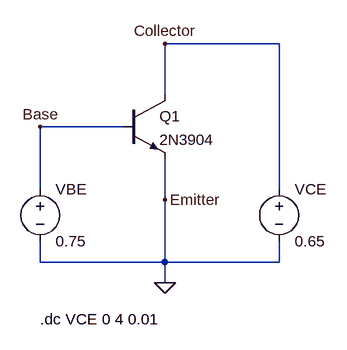
[diagram p0: schematic Lab7p1.asc]
Lab7p1.asc, the LTspice schematic file:
Version 4
SHEET 1 880 680
WIRE 464 -80 288 -80
WIRE 288 0 288 -80
WIRE 224 48 96 48
WIRE 96 144 96 48
WIRE 464 144 464 -80
WIRE 288 160 288 96
WIRE 96 256 96 224
WIRE 288 256 288 160
WIRE 288 256 96 256
WIRE 464 256 464 224
WIRE 464 256 288 256
WIRE 288 288 288 256
FLAG 288 288 0
FLAG 288 -80 Collector
FLAG 96 48 Base
FLAG 288 160 Emitter
SYMBOL voltage 96 128 R0
WINDOW 123 0 0 Left 0
WINDOW 39 0 0 Left 0
SYMATTR InstName VBE
SYMATTR Value 0.75
SYMBOL voltage 464 128 R0
WINDOW 123 0 0 Left 0
WINDOW 39 0 0 Left 0
SYMATTR InstName VCE
SYMATTR Value 0.65
SYMBOL npn 224 0 R0
SYMATTR InstName Q1
SYMATTR Value 2N3904
TEXT 96 344 Left 2 !.dc VCE 0 4 0.01

The netlist it stands for:
* Lab7p1.asc
VBE Base 0 0.75
VCE Collector 0 0.65
Q1 Collector Base 0 0 2N3904
.model NPN NPN
.model PNP PNP
.lib standard.bjt
.dc VCE 0 4 0.01
.backanno
.end

* Results of the author's LTspice run, read from the files saved beside the schematic
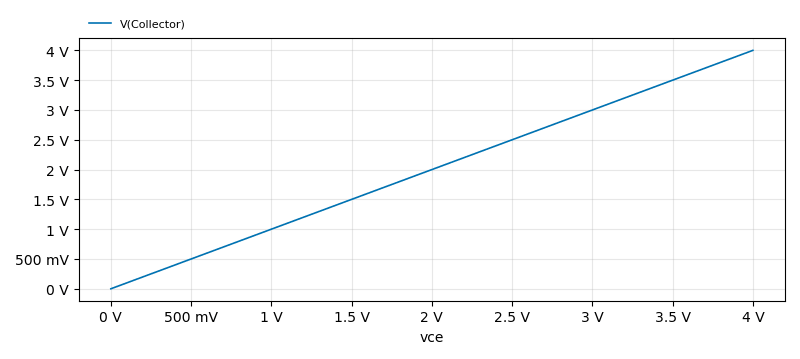
[diagram p1: DC transfer characteristic of Lab7p1.asc, plotted from the saved traces]
* DC transfer characteristic, 1 run:
*   V(Collector): 0 V at vce=0 V, 4 V at vce=4 V, min 0 V, max 4 V